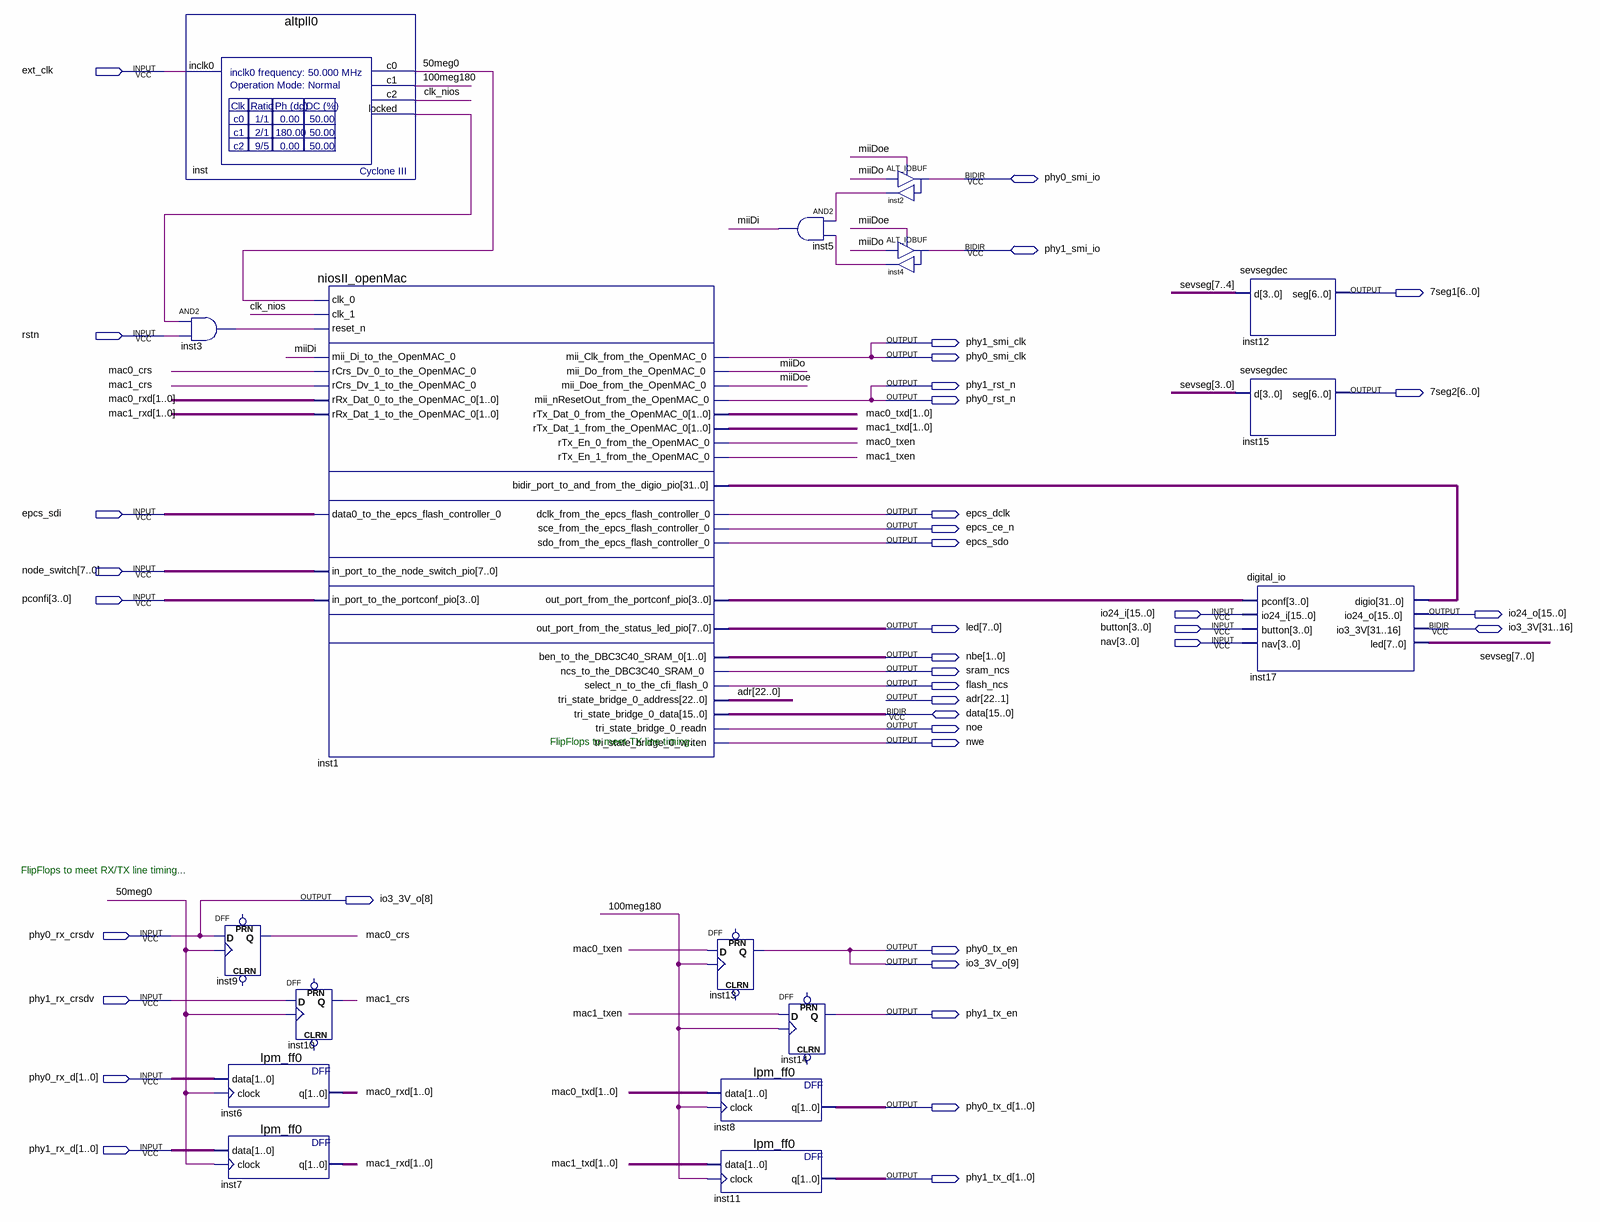
[diagram p0: schematic sheet]
// Quartus schematic nios_pll.bdf as structural Verilog: 17 symbols, 39 pins
module nios_pll (
  input  ext_clk,
  input  rstn,
  input  epcs_sdi,
  input  [7:0] node_switch,
  input  [3:0] pconfi,
  input  [15:0] io24_i,
  input  [3:0] button,
  input  [3:0] nav,
  input  phy0_rx_crsdv,
  input  phy1_rx_crsdv,
  input  [1:0] phy0_rx_d,
  input  [1:0] phy1_rx_d,
  inout  phy0_smi_io,
  inout  phy1_smi_io,
  inout  [31:16] io3_3V,
  inout  [15:0] data,
  output [6:0] \7seg1 ,
  output phy1_smi_clk,
  output phy0_smi_clk,
  output phy1_rst_n,
  output [6:0] \7seg2 ,
  output phy0_rst_n,
  output epcs_dclk,
  output epcs_ce_n,
  output epcs_sdo,
  output [15:0] io24_o,
  output [7:0] led,
  output [1:0] nbe,
  output sram_ncs,
  output flash_ncs,
  output [22:0] adr,
  output noe,
  output nwe,
  output [9:8] io3_3V_o,
  output phy0_tx_en,
  output phy1_tx_en,
  output [1:0] phy0_tx_d,
  output [1:0] phy1_tx_d
);

  wire \50meg0 , \100meg180 , clk_nios, inst2_o, inst3_out, inst4_o, inst_locked, mac0_crs, mac0_txen,
       mac1_crs, mac1_txen, miiDi, miiDo, miiDoe;
  wire [1:0] mac0_rxd, mac0_txd, mac1_rxd, mac1_txd;
  wire [3:0] inst1_out_port_from_the_portconf_pio;
  wire [7:0] sevseg;
  wire [31:0] inst1_bidir_port_to_and_from_the_digio_pio;

  altpll0 inst (.inclk0(ext_clk), .c0(\50meg0 ), .c1(\100meg180 ), .c2(clk_nios), .locked(inst_locked));
  and inst3 (inst3_out, inst_locked, rstn);
  DFF inst9 (.CLK(\50meg0 ), .D(phy0_rx_crsdv), .Q(mac0_crs));  // open: CLRN, PRN
  lpm_ff0 inst6 (.data(phy0_rx_d), .clock(\50meg0 ), .q(mac0_rxd));
  lpm_ff0 inst7 (.data(phy1_rx_d), .clock(\50meg0 ), .q(mac1_rxd));
  niosII_openMac inst1 (
    .clk_0(\50meg0 ), .clk_1(clk_nios), .reset_n(inst3_out), .mii_Di_to_the_OpenMAC_0(miiDi),
    .rCrs_Dv_0_to_the_OpenMAC_0(mac0_crs), .rCrs_Dv_1_to_the_OpenMAC_0(mac1_crs),
    .rRx_Dat_0_to_the_OpenMAC_0(mac0_rxd), .rRx_Dat_1_to_the_OpenMAC_0(mac1_rxd),
    .data0_to_the_epcs_flash_controller_0(epcs_sdi), .in_port_to_the_node_switch_pio(node_switch),
    .in_port_to_the_portconf_pio(pconfi), .mii_Clk_from_the_OpenMAC_0(phy0_smi_clk),
    .mii_Do_from_the_OpenMAC_0(miiDo), .mii_Doe_from_the_OpenMAC_0(miiDoe),
    .mii_nResetOut_from_the_OpenMAC_0(phy0_rst_n), .rTx_Dat_0_from_the_OpenMAC_0(mac0_txd),
    .rTx_Dat_1_from_the_OpenMAC_0(mac1_txd), .rTx_En_0_from_the_OpenMAC_0(mac0_txen),
    .rTx_En_1_from_the_OpenMAC_0(mac1_txen), .dclk_from_the_epcs_flash_controller_0(epcs_dclk),
    .sce_from_the_epcs_flash_controller_0(epcs_ce_n), .sdo_from_the_epcs_flash_controller_0(epcs_sdo),
    .out_port_from_the_portconf_pio(inst1_out_port_from_the_portconf_pio),
    .out_port_from_the_status_led_pio(led), .ben_to_the_DBC3C40_SRAM_0(nbe),
    .ncs_to_the_DBC3C40_SRAM_0(sram_ncs), .select_n_to_the_cfi_flash_0(flash_ncs),
    .tri_state_bridge_0_address(adr), .tri_state_bridge_0_readn(noe), .tri_state_bridge_0_writen(nwe),
    .bidir_port_to_and_from_the_digio_pio(inst1_bidir_port_to_and_from_the_digio_pio),
    .tri_state_bridge_0_data(data));
  DFF inst10 (.CLK(\50meg0 ), .D(phy1_rx_crsdv), .Q(mac1_crs));  // open: CLRN, PRN
  DFF inst13 (.CLK(\100meg180 ), .D(mac0_txen), .Q(io3_3V_o[9]));  // open: CLRN, PRN
  lpm_ff0 inst8 (.data(mac0_txd), .clock(\100meg180 ), .q(phy0_tx_d));
  lpm_ff0 inst11 (.data(mac1_txd), .clock(\100meg180 ), .q(phy1_tx_d));
  and inst5 (miiDi, inst2_o, inst4_o);
  DFF inst14 (.CLK(\100meg180 ), .D(mac1_txen), .Q(phy1_tx_en));  // open: CLRN, PRN
  ALT_IOBUF inst2 (.i(miiDo), .oe(miiDoe), .o(inst2_o), .io(phy0_smi_io));
  ALT_IOBUF inst4 (.i(miiDo), .oe(miiDoe), .o(inst4_o), .io(phy1_smi_io));
  sevsegdec inst12 (.d(sevseg[7:4]), .seg(\7seg1 ));
  sevsegdec inst15 (.d(sevseg[3:0]), .seg(\7seg2 ));
  digital_io inst17 (
    .pconf(inst1_out_port_from_the_portconf_pio), .io24_i(io24_i), .button(button), .nav(nav),
    .io24_o(io24_o), .io3_3V(io3_3V), .led(sevseg), .digio(inst1_bidir_port_to_and_from_the_digio_pio));

  assign io3_3V_o[8] = phy0_rx_crsdv;
  assign phy0_tx_en = io3_3V_o[9];
  assign phy1_rst_n = phy0_rst_n;
  assign phy1_smi_clk = phy0_smi_clk;

  // Notes on the sheet:
  //   FlipFlops to meet TX line timing...
  //   FlipFlops to meet RX/TX line timing...
endmodule
